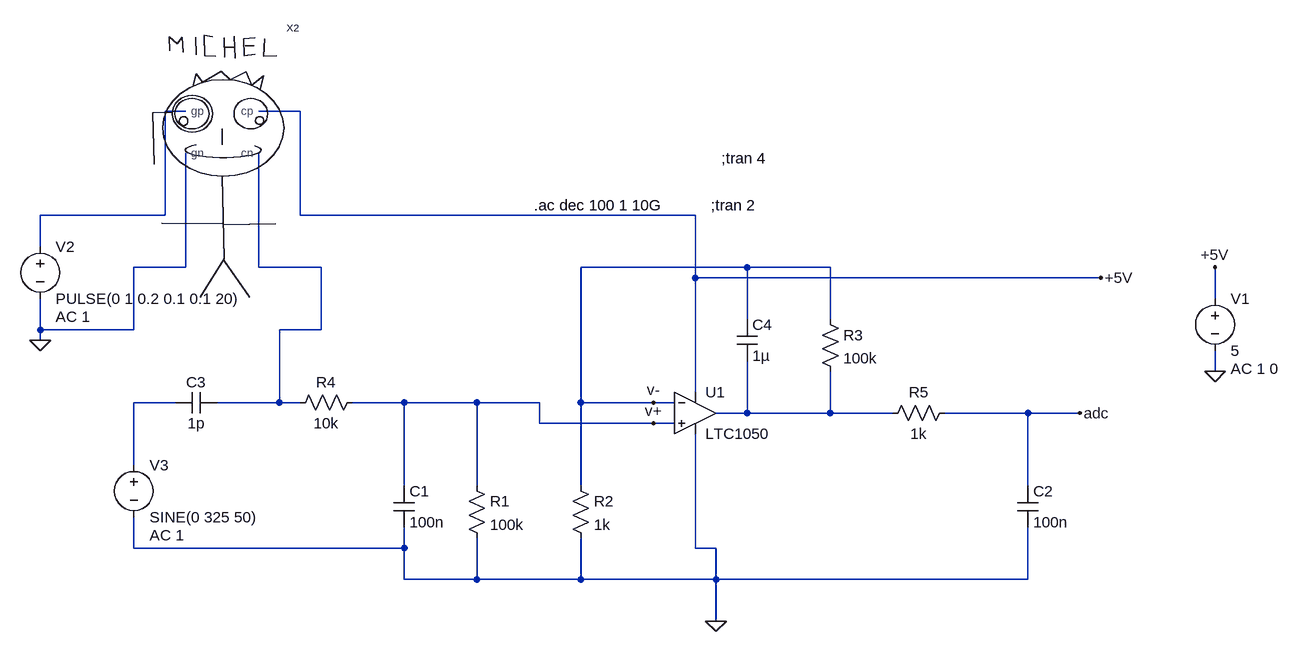
[diagram p0: schematic calcul-r-sensor.asc]
calcul-r-sensor.asc, the LTspice schematic file:
Version 4
SHEET 1 900 692
WIRE -784 -112 -816 -112
WIRE -608 -112 -672 -112
WIRE -816 48 -816 -112
WIRE -816 48 -1008 48
WIRE -608 48 -608 -112
WIRE 0 48 -608 48
WIRE -1008 96 -1008 48
WIRE -784 128 -784 -48
WIRE -784 128 -864 128
WIRE -672 128 -672 -48
WIRE -576 128 -672 128
WIRE 80 128 -176 128
WIRE 208 128 80 128
WIRE 0 144 0 48
WIRE 624 144 0 144
WIRE 800 176 800 128
WIRE 80 208 80 128
WIRE 208 208 208 128
WIRE -1008 224 -1008 176
WIRE -864 224 -864 128
WIRE -864 224 -1008 224
WIRE -576 224 -576 128
WIRE -576 224 -640 224
WIRE -1008 240 -1008 224
WIRE 800 288 800 256
WIRE 0 320 0 144
WIRE -800 336 -864 336
WIRE -640 336 -640 224
WIRE -640 336 -736 336
WIRE -608 336 -640 336
WIRE -448 336 -528 336
WIRE -336 336 -448 336
WIRE -240 336 -336 336
WIRE -176 336 -176 128
WIRE -64 336 -176 336
WIRE -32 336 -64 336
WIRE 80 352 80 272
WIRE 80 352 32 352
WIRE 208 352 208 288
WIRE 208 352 80 352
WIRE 304 352 208 352
WIRE 512 352 384 352
WIRE 592 352 512 352
WIRE -240 368 -240 336
WIRE -64 368 -240 368
WIRE -32 368 -64 368
WIRE -864 432 -864 336
WIRE -448 464 -448 336
WIRE -336 464 -336 336
WIRE -176 464 -176 336
WIRE 512 464 512 352
WIRE -864 560 -864 512
WIRE -448 560 -448 528
WIRE -448 560 -864 560
WIRE 0 560 0 384
WIRE 32 560 0 560
WIRE -448 608 -448 560
WIRE -336 608 -336 544
WIRE -336 608 -448 608
WIRE -176 608 -176 544
WIRE -176 608 -336 608
WIRE 32 608 32 560
WIRE 32 608 -176 608
WIRE 512 608 512 528
WIRE 512 608 32 608
WIRE 32 672 32 608
FLAG 592 352 adc
FLAG 32 672 0
FLAG 800 288 0
FLAG 800 128 +5V
FLAG 624 144 +5V
FLAG -64 336 v-
FLAG -64 368 v+
FLAG -1008 240 0
SYMBOL OpAmps\\LTC1050 0 288 R0
SYMATTR InstName U1
SYMBOL res -352 448 R0
SYMATTR InstName R1
SYMATTR Value 100k
SYMBOL res -192 448 R0
SYMATTR InstName R2
SYMATTR Value 1k
SYMBOL res 192 192 R0
SYMATTR InstName R3
SYMATTR Value 100k
SYMBOL res -512 320 R90
WINDOW 0 0 56 VBottom 2
WINDOW 3 32 56 VTop 2
SYMATTR InstName R4
SYMATTR Value 10k
SYMBOL res 400 336 R90
WINDOW 0 0 56 VBottom 2
WINDOW 3 32 56 VTop 2
SYMATTR InstName R5
SYMATTR Value 1k
SYMBOL cap -464 464 R0
SYMATTR InstName C1
SYMATTR Value 100n
SYMBOL cap 496 464 R0
SYMATTR InstName C2
SYMATTR Value 100n
SYMBOL cap 64 208 R0
SYMATTR InstName C4
SYMATTR Value 1µ
SYMBOL voltage 800 160 R0
WINDOW 123 24 124 Left 2
WINDOW 39 0 0 Left 0
SYMATTR Value2 AC 1 0
SYMATTR InstName V1
SYMATTR Value 5
SYMBOL voltage -1008 80 R0
WINDOW 123 24 124 Left 2
WINDOW 39 0 0 Left 0
SYMATTR InstName V2
SYMATTR Value PULSE(0 1 0.2 0.1 0.1 20)
SYMATTR Value2 AC 1
SYMBOL voltage -864 416 R0
WINDOW 123 24 124 Left 2
WINDOW 39 0 0 Left 0
SYMATTR InstName V3
SYMATTR Value SINE(0 325 50)
SYMATTR Value2 AC 1
SYMBOL cap -736 320 R90
WINDOW 0 0 32 VBottom 2
WINDOW 3 32 32 VTop 2
SYMATTR InstName C3
SYMATTR Value 1p
SYMBOL smiley -784 -80 R0
SYMATTR InstName X2
TEXT 24 32 Left 2 !;tran 2
TEXT 40 -40 Left 2 !;tran 4
TEXT -248 32 Left 2 !.ac dec 100 1 10G

The netlist it stands for:
* calcul-r-sensor.asc
XU1 v+ v- +5V 0 N004 LTC1050  ; pins In+ In- V+ V- OUT
R1 v+ 0 100k
R2 v- 0 1k
R3 v- N004 100k
R4 v+ N002 10k
R5 adc N004 1k
C1 v+ 0 100n
C2 adc 0 100n
C4 v- N004 1µ
V1 +5V 0 5 AC 1 0
V2 N001 0 PULSE(0 1 0.2 0.1 0.1 20) AC 1
V3 N003 0 SINE(0 325 50) AC 1
C3 N002 N003 1p
XX2 N001 +5V 0 N002 smiley  ; pins gp cp gn cn
;tran 2
;tran 4
.ac dec 100 1 10G
.lib LTC.lib
.backanno
.end